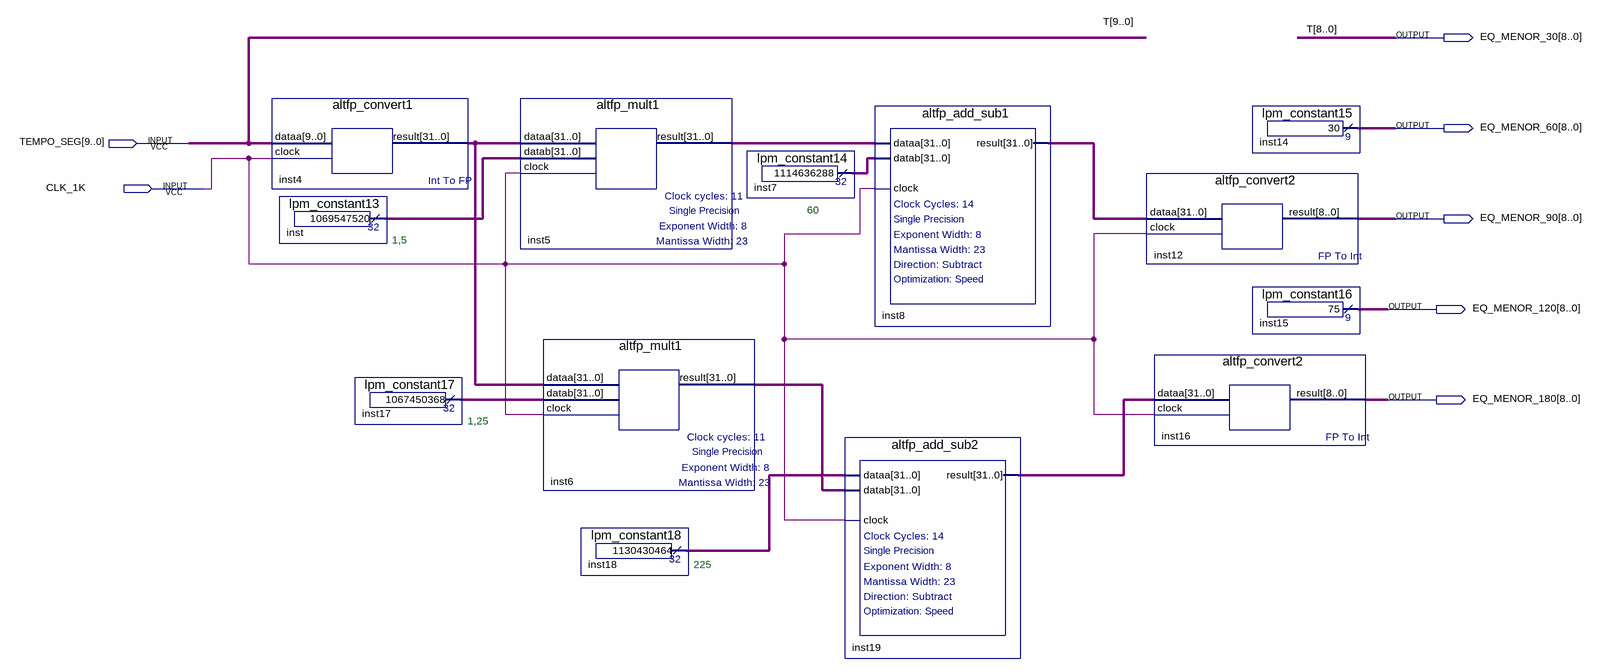
[diagram p0: schematic sheet]
// Quartus schematic curva.bdf as structural Verilog: 13 symbols, 7 pins
module curva (
  input  [9:0] TEMPO_SEG,
  input  CLK_1K,
  output [8:0] EQ_MENOR_30,
  output [8:0] EQ_MENOR_60,
  output [8:0] EQ_MENOR_90,
  output [8:0] EQ_MENOR_120,
  output [8:0] EQ_MENOR_180
);

  wire [31:0] inst4_result, inst5_result, inst6_result, inst7_result, inst8_result, inst17_result,
       inst18_result, inst19_result, inst_result;

  altfp_convert1 inst4 (.dataa(TEMPO_SEG), .clock(CLK_1K), .result(inst4_result));
  lpm_constant13 inst (.result(inst_result));
  lpm_constant17 inst17 (.result(inst17_result));
  altfp_mult1 inst5 (.dataa(inst4_result), .datab(inst_result), .clock(CLK_1K), .result(inst5_result));
  altfp_mult1 inst6 (.dataa(inst4_result), .datab(inst17_result), .clock(CLK_1K), .result(inst6_result));
  lpm_constant18 inst18 (.result(inst18_result));
  lpm_constant14 inst7 (.result(inst7_result));
  altfp_add_sub2 inst19 (.dataa(inst18_result), .datab(inst6_result), .clock(CLK_1K), .result(inst19_result));
  altfp_add_sub1 inst8 (.dataa(inst5_result), .datab(inst7_result), .clock(CLK_1K), .result(inst8_result));
  altfp_convert2 inst12 (.dataa(inst8_result), .clock(CLK_1K), .result(EQ_MENOR_90));
  altfp_convert2 inst16 (.dataa(inst19_result), .clock(CLK_1K), .result(EQ_MENOR_180));
  lpm_constant15 inst14 (.result(EQ_MENOR_60));
  lpm_constant16 inst15 (.result(EQ_MENOR_120));

  assign EQ_MENOR_30 = TEMPO_SEG[8:0];

  // Other names for the same wires on the sheet: T[9:0] = TEMPO_SEG

  // Notes on the sheet:
  //   60
  //   1,5
  //   1,25
  //   225
endmodule
